# Altium project Laser_driver.PrjPCB (part 2 of 3)

## Sheet LD.SchDoc
size A2; SPICEModelCacheJOXINVFD: <root> / <DocumentId>JOXINVFD</DocumentId> / <CacheFrame Number="0"> / <Model Name="0603_885012206095_100nf" Kind="CKT"> / <Text>******* / .subckt 0603_885012206095_100nF 1 2 / Rser 1 3 0.0157659152881 / Lser 2 4 3.10171966E-10 / C1 3 4 0.0000001 / Rpar 3 4 5000000000 / .ends 0603_885012206095_100nF</Text> / </Model> / </CacheFrame> / </root>
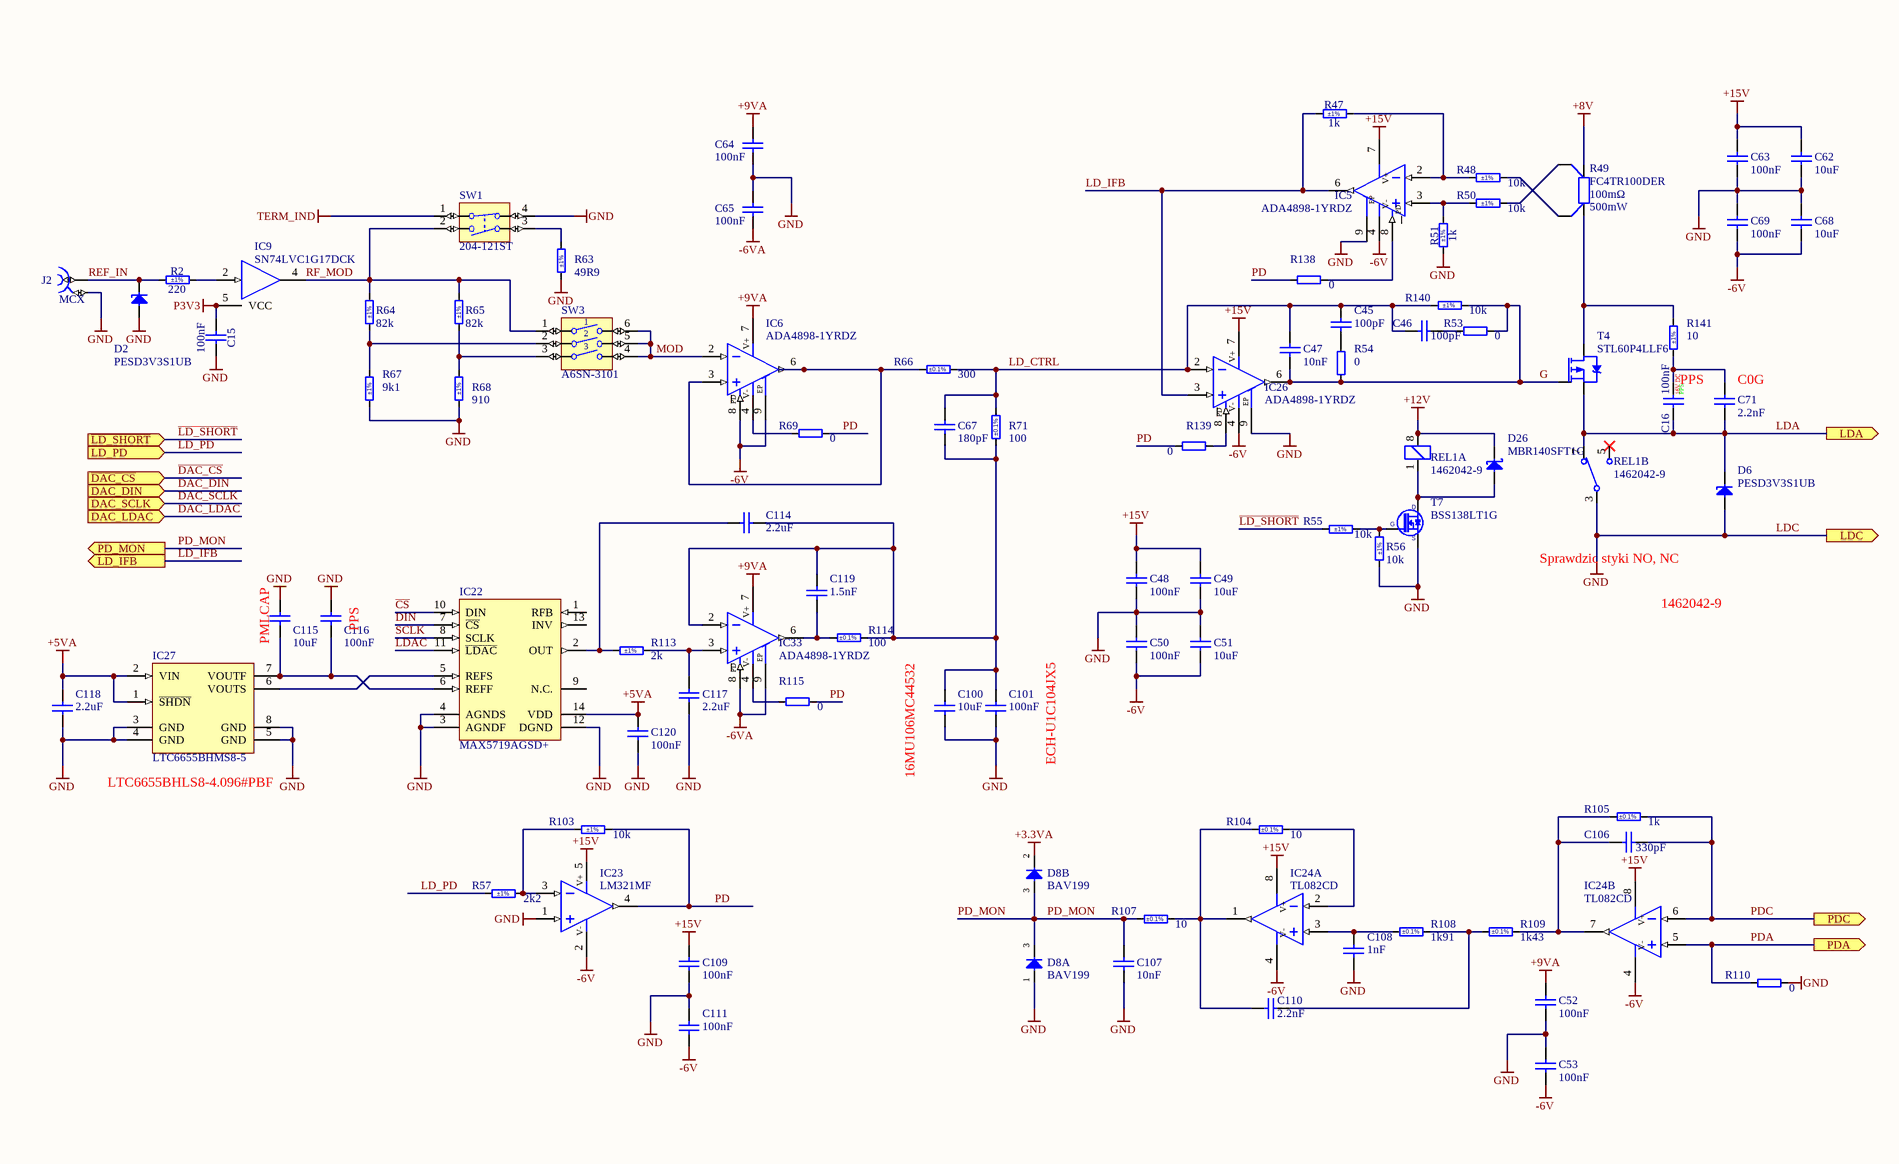
[diagram p2: LD.SchDoc, left]
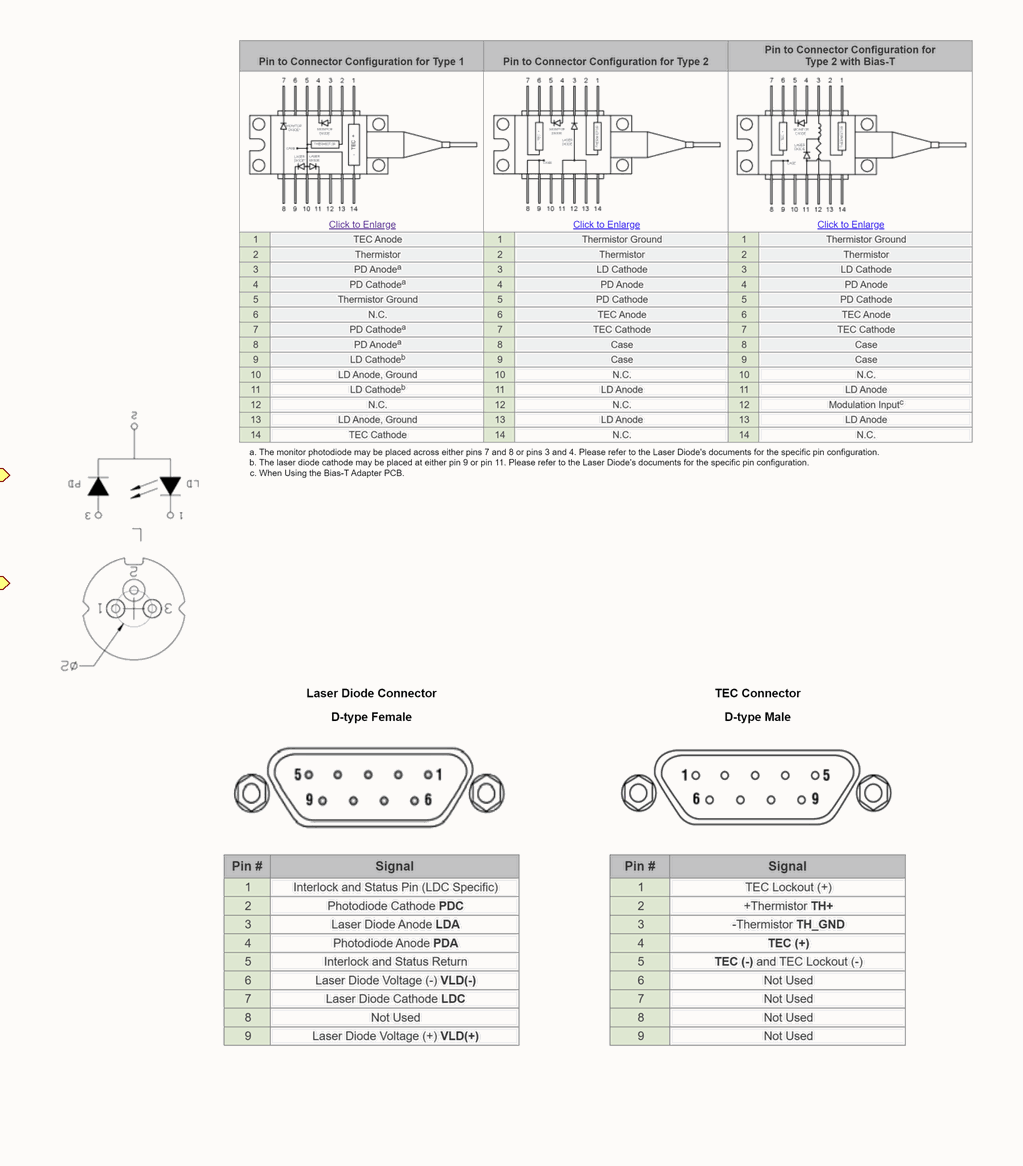
[diagram p3: LD.SchDoc, right]

### Parts
C15  100nF  [CAPC1005X55N]
C16  100nF  Value3: 16V DC  DielectrikType: PPS  [PPS_G3_size]
C45  100pF  [CAPC1608X90N]
C46  100pF  [CAPC1608X90N]
C47  10nF  [CAPC1608X87N]
C48  100nF  [WCAP-CSGP_0603_L1.6W0.8H0.8_Reflow]
C49  10uF  [CAPC1709X100N]
C50  100nF  [WCAP-CSGP_0603_L1.6W0.8H0.8_Reflow]
C51  10uF  [CAPC1709X100N]
C52  100nF  [WCAP-CSGP_0603_L1.6W0.8H0.8_Reflow]
C53  100nF  [WCAP-CSGP_0603_L1.6W0.8H0.8_Reflow]
C62  10uF  [CAPC1709X100N]
C63  100nF  [WCAP-CSGP_0603_L1.6W0.8H0.8_Reflow]
C64  100nF  [WCAP-CSGP_0603_L1.6W0.8H0.8_Reflow]
C65  100nF  [WCAP-CSGP_0603_L1.6W0.8H0.8_Reflow]
C67  180pF  [CAPC1608X87N]
C68  10uF  [CAPC1709X100N]
C69  100nF  [WCAP-CSGP_0603_L1.6W0.8H0.8_Reflow]
C71  2.2nF  [CAPC1608X87N]
C100  10uF  [CAPC1709X100N]
C101  100nF  [CAPC3225X230N]
C106  330pF  [CAPC1608X87N]
C107  10nF  [CAPC1608X87N]
C108  1nF  [CAPC1608X90N]
C109  100nF  [WCAP-CSGP_0603_L1.6W0.8H0.8_Reflow]
C110  2.2nF  [CAPC1608X87N]
C111  100nF  [WCAP-CSGP_0603_L1.6W0.8H0.8_Reflow]
C114  2.2uF  [CAPC2012X135N]
C115  10uF  [CAPC1709X100N]
C116  100nF  [CAPC3225X230N]
C117  2.2uF  [CAPC2012X135N]
C118  2.2uF  [CAPC2012X135N]
C119  1.5nF  [CAPC1608X87N]
C120  100nF  [CAPC3225X230N]
D2  PESD3V3S1UB  [SODFL1608X65N]
D6  PESD3V3S1UB  [SODFL1608X65N]
D8  BAV199  [SOT95P240X110-3N]  (parts A,B of 2)
D26  MBR140SFT1G  [SOD-123FL]
IC5  ADA4898-1YRDZ  [SOIC127P600X175-9N-S229]
IC6  ADA4898-1YRDZ  [SOIC127P600X175-9N-S229]
IC9  SN74LVC1G17DCK  [SOT65P210X110-5N]
IC22  MAX5719AGSD+  [SOIC127P600X175-14N]
IC23  LM321MF  [SOT95P280X145-5N]
IC24  TL082CD  [SOIC127P600X175-8N]  (parts A,B of 2)
IC26  ADA4898-1YRDZ  [SOIC127P600X175-9N-S229]
IC27  LTC6655BHMS8-5  [SOP65P490X110-8N]
IC33  ADA4898-1YRDZ  [SOIC127P600X175-9N-S229]
J2  MCX  [AMPHENOL_919-109J-51PX]
R2  220  Tolerance: ±1%  [RESC1005X40N]
R47  1k  Tolerance: ±1%  [RESC1608X55N]
R48  10k  Tolerance: ±1%  [RESC1608X55N]
R49  FC4TR100DER  Value1: 100mΩ  Value2: 500mW  [FC4T]
R50  10k  Tolerance: ±1%  [RESC1608X55N]
R51  1k  Tolerance: ±1%  [RESC1608X55N]
R53  0  [RESC1608X55N]
R54  0  [RESC1608X55N]
R55  10k  Tolerance: ±1%  [RESC1608X55N]
R56  10k  Tolerance: ±1%  [RESC1608X55N]
R57  2k2  Tolerance: ±1%  [RESC1005X40N]
R63  49R9  Tolerance: ±1%  [RESC1608X55N]
R64  82k  Tolerance: ±1%  [RESC1608X55N]
R65  82k  Tolerance: ±1%  [RESC1608X55N]
R66  300  Tolerance: ±0.1%  [RESC1608X64N]
R67  9k1  Tolerance: ±1%  [RESC1608X55N]
R68  910  Tolerance: ±1%  [RESC1608X55N]
R69  0  [RESC1608X55N]
R71  100  Tolerance: ±0.1%  [RESC1608X55N]
R103  10k  Tolerance: ±1%  [RESC1608X55N]
R104  10  Tolerance: ±0.1%  [RESC1608X55N]
R105  1k  Tolerance: ±0.1%  [RESC1608X64N]
R107  10  Tolerance: ±0.1%  [RESC1608X55N]
R108  1k91  Tolerance: ±0.1%  [RESC1608X55N]
R109  1k43  Tolerance: ±0.1%  [RESC1608X55N]
R110  0  [RESC1608X55N]
R113  2k  Tolerance: ±1%  [RESC1608X55N]
R114  100  Tolerance: ±0.1%  [RESC1608X55N]
R115  0  [RESC1608X55N]
R138  0  [RESC1608X55N]
R139  0  [RESC1608X55N]
R140  10k  Tolerance: ±1%  [RESC1608X55N]
R141  10  Tolerance: ±1%  [RESC3216X65N]
REL1  1462042-9  [1462042-9]  (parts A,B of 2)
SW1  Manufacturer Part Number: 204-121ST  [SW_CTS_204-121ST]  (hidden comment: Switch)
SW3  Manufacturer Part Number: A6SN-3101  [SW_OMRON_A6SN-3101]  (hidden comment: Switch)
T4  STL60P4LLF6  [8-PowerVDFN]
T7  BSS138LT1G  [SOT95P240X110-3N]

### Ports
DAC_DIN (in), DAC_LDAC (in), DAC_SCLK (in), LD_IFB (out), LD_PD (in), LDA (out), LDC (out), PD_MON (out), PDA (out), PDC (out), ~{DAC_CS} (in), ~{LD_SHORT} (in)

### Nets
+3.3VA: D8.2(C)
+5VA: C118.2 C120.1 IC22.14(VDD) IC27.1(~{SHDN}) IC27.2(VIN)
+8V: R49.4
+9VA: C52.2 C64.2 IC6.7(V+) IC33.7(V+)
+12V: D26.1(C) REL1.8(A2-)
+15V: C48.2 C49.2 C62.2 C63.2 C109.2 IC5.7(V+) IC24.8(V+) IC26.7(V+)
-6V: C50.1 C51.1 C53.1 C68.1 C69.1 C111.1 IC5.4(V-) IC6.8(~{DS}) IC6.9(EP) IC23.2(V-) IC24.4(V-) IC26.4(V-)
-6VA: C65.1 IC33.8(~{DS}) IC33.9(EP)
LDC: C15.1 C48.1 C49.1 C50.2 C51.2 C52.1 C53.2 C62.1 C63.1 C64.1 C65.2 C68.2 C69.2 C100.1 C101.1 C107.1 C108.1 C109.1 C111.2 C115.2 C116.2 C117.1 C118.1 C120.2 D2.2(A) D6.2(A) D8.1(A) IC5.9(EP) IC9.3(GND) IC22.3(AGNDF) IC22.4(AGNDS) IC22.12(DGND) IC23.1(IN+) IC26.9(EP) IC27.3(GND) IC27.4(GND) IC27.5(GND) IC27.8(GND) J2.2 R51.1 R56.1 R63.2 R67.1 R68.1 R110.2 REL1.3 SW1.4 T7.2(S) ; port LDC  [also labelled GND]
P3V3: C15.2 IC9.5(VCC)
TERM_IND: SW1.1
~{CS}: IC22.10(DIN)
~{DAC_CS}: port ~{DAC_CS}  [project net ~{CS}]
DAC_DIN: port DAC_DIN
DAC_~{LDAC}: port DAC_LDAC
DAC_SCLK: port DAC_SCLK
DIN: IC22.7(~{CS})
G: C47.1 IC26.6(OUT) R53.2 R54.1 R140.2 T4.4(G)
~{LD_SHORT}: R55.1 ; port ~{LD_SHORT}
~{LDAC}: IC22.11(~{LDAC})
LD_CTRL: C45.2 C46.1 C47.2 C67.2 IC26.2(IN-) R66.2 R71.2 R140.1
LD_IFB: IC5.6(OUT) IC26.3(IN+) R47.1 ; port LD_IFB
LD_PD: R57.1 ; port LD_PD
LDA: C16.1 C71.1 D6.1(C) REL1.7 T4.1,_2,_3(S) ; port LDA
MOD: IC6.2(IN-) SW3.4 SW3.5 SW3.6
PD: IC23.4(OUT) R69.2 R103.2 R115.2 R138.1 R139.2
PD_MON: C107.2 D8.3(COMAC) R107.1 ; port PD_MON
PDA: IC24.5(IN+) R110.1 ; port PDA
PDC: C106.2 IC24.6(IN-) R105.2 ; port PDC
REF_IN: D2.1(C) J2.1 R2.2
RF_MOD: IC9.4(OUT) R64.2 R65.2 SW1.2 SW3.1
SCLK: IC22.8(SCLK)
NetC16_2: C16.2 C71.2 R141.1
NetC45_1: C45.1 R54.2
NetC46_2: C46.2 R53.1
NetC67_1: C67.1 C100.2 C101.2 C114.2 C119.2 IC33.2(IN-) R71.1 R114.2
NetC106_1: C106.1 IC24.7(OUT) R105.1 R109.2
NetC108_2: C108.2 IC24.3(IN+) R108.1
NetC110_1: C110.1 IC24.1(OUT) R104.1 R107.2
NetC110_2: C110.2 R108.2 R109.1
NetC114_1: C114.1 IC22.2(OUT) R113.1
NetC115_1: C115.1 C116.1 IC22.6(REFF) IC27.7(VOUTF)
NetC117_2: C117.2 IC33.3(IN+) R113.2
NetC119_1: C119.1 IC33.6(OUT) R114.1
NetD26_2: D26.2(A) REL1.1(A1+) T7.3(D)
NetIC5_2: IC5.2(IN-) R47.2 R48.1
NetIC5_3: IC5.3(IN+) R50.1 R51.2
NetIC5_8: IC5.8(~{DS}) R138.2
NetIC6_3: IC6.3(IN+) IC6.6(OUT) R66.1
NetIC6_4: IC6.4(V-) R69.1
NetIC9_2: IC9.2(IN) R2.1
NetIC22_5: IC22.5(REFS) IC27.6(VOUTS)
NetIC23_3: IC23.3(IN-) R57.2 R103.1
NetIC24_2: IC24.2(IN-) R104.2
NetIC26_8: IC26.8(~{DS}) R139.1
NetIC33_4: IC33.4(V-) R115.1
NetR48_2: R48.2 R49.2
NetR49_1: R49.1 R50.2
NetR49_3: R49.3 R141.2 T4.5(D)
NetR55_2: R55.2 R56.2 T7.1(G)
NetR63_1: R63.1 SW1.3
NetR64_1: R64.1 R67.2 SW3.2
NetR65_1: R65.1 R68.2 SW3.3

Not connected (* = marked no-connect by the designer): IC22 1(RFB) 9(N.C.) 13(INV); IC23 5(V+); REL1 5*

### Notes on the sheet
- (near C16) PPS
- (near C71) C0G
- Sprawdzic styki NO, NC
- 1462042-9
- (near C115) PMLCAP
- (near C116) PPS
- (near IC27) LTC6655BHLS8-4.096#PBF
- (near C100) 16MU106MC44532
- (near C101) ECH-U1C104JX5
- Labels drawn without touching a wire or pin: +15V
- (in symbol ADA4898-1YRDZ) PD

### Library data of the parts
C15 = CC0402_100NF_16V_10%_X7R: Non-polarised capacitor; Part Description: SMD Multilayer Chip Ceramic Capacitor; Manufacturer: GENERIC; Manufacturer1 Part Number: GRM155R71C104KA88D; Voltage: 16V; TC: X7R; Tolerance: ±10%; Part Number: CC0402_100NF_16V_10%_X7R; Component Kind: Standard; Component Type: Standard; Pin Count: 2; Value: 100nF; Status: Not Recommended; Manufacturer Part Number: CC0402_100NF_16V_10%_X7R; Case: 0402; Mounted: Yes; Socket: No; SMD: Yes; Sense: No; Manufacturer1 Example: MURATA; Manufacturer1 ComponentHeight: 0.55mm; HelpURL: \\cern.ch\dfs\Applications\Altium\Datasheets\CC0402_X7R_MURATA_GRM.pdf; Author: CERN DEM JLC; CreateDate: 05.12.2013; LatestRevisionDate: 03.12.2007
C16 = 100nF/50V/1206/PPS: 0.1 µF Film Capacitor 11V 16V Polyphenylene Sulfide (PPS), Metallized - Stacked 1210 (3225 Metric); Manufacture: Panasonic; Assembly: SMD; Parameter1: Cap; Parameter2: Vr AC; ComponentSymbol: ECH-U1C104JX5; Tolerance1: ±5%; Parameter3: Vr DC; Value2: 11V AC; ComponentLink1URL: https://industrial.panasonic.com/cdbs/www-data/pdf/RDI0000/ABD0000C173.pdf; ComponentLink1Description: Datasheet; Shop1ID: *; ComponentType: Capacitor; Tolerance2: *; Value1: 100nF
C45 C46 = CC0603_100PF_50V_1%_NP0: Non-polarised capacitor; Part Description: SMD Multilayer Chip Ceramic Capacitor; Manufacturer: GENERIC; Manufacturer1 Part Number: 06035A101FAT2A; Voltage: 50V; TC: C0G/NP0; Tolerance: ±1%; Part Number: CC0603_100PF_50V_1%_NP0; Component Kind: Standard; Component Type: Standard; Pin Count: 2; Value: 100pF; Status: None; Manufacturer Part Number: CC0603_100PF_50V_1%_NP0; Case: 0603; Mounted: Yes; Socket: No; SMD: Yes; Sense: No; Manufacturer1 Example: AVX; Manufacturer1 ComponentHeight: 0.9mm; HelpURL: \\cern.ch\dfs\Applications\Altium\Datasheets\CC0603_C0G_AVX.pdf; Author: CERN DEM JLC; CreateDate: 15.06.2017; LatestRevisionDate: 15.06.2017
C47 C107 = CC0603_10NF_25V_1%_C0G: Non-polarised capacitor; Part Description: SMD Multilayer Chip Ceramic Capacitor; Manufacturer: GENERIC; Manufacturer1 Part Number: C0603C103F3GEC; Voltage: 25V; TC: C0G/NP0; Tolerance: ±1%; Part Number: CC0603_10NF_25V_1%_C0G; Component Kind: Standard; Component Type: Standard; Pin Count: 2; Value: 10nF; Status: None; Manufacturer Part Number: CC0603_10NF_25V_1%_C0G; Case: 0603; Mounted: Yes; Socket: No; SMD: Yes; Sense: No; Manufacturer1 Example: KEMET; Manufacturer1 ComponentHeight: 0.87mm; HelpURL: \\cern.ch\dfs\Applications\Altium\Datasheets\CC0603_ESD_C0G_KEMET.pdf; Author: CERN DEM HF; CreateDate: 07.02.2024; LatestRevisionDate: 07.02.2024
C48 C50 C52 C53 C63-C65 C69 C109 C111 = 885012206095: WCAP-CSGP Multilayer Ceramic Chip Capacitor, General Purpose, size 0603, 100nF, 50V; Manufacturer: Wurth Elektronik; Case/Size Code: 0603; Capacitance Tolerance: +/-10%; Ceramic Type: X7R; Dissipation Factor: 3%; Insulation Resistance: 5GΩ; Technical Reference: X7R0603104K050DFCT10000; Manufacturer Part Number: 885012206095; Category: Multilayer Ceramic Chip Capacitors; Match Code: WCAP-CSGP; ComponentLink1Description: Website Link; ComponentLink1URL: https://www.we-online.com/redexpert/article/885012206095?ad; ComponentLink2Description: Datasheet Link; ComponentLink2URL: https://www.we-online.com/redexpert/spec/885012206095?ad; Mount: Surface Mount; Min Operating Temperature: -55°C; Max Operating Temperature: 125°C; Packaging: Tape and Reel; Length: 1.6mm; Width: 0.8mm; Height: 0.8mm; Capacitance: 100nF; Rated Voltage (DC): 50V
C49 C51 C62 C68 C100 C115 = CC0603_10UF_6.3V_20%_X7R_SAMSUNG_CL: Non-polarised capacitor; Part Description: SMD Multilayer Chip Ceramic Capacitor; Manufacturer: SAMSUNG ELECTRO-MECHANICS; Manufacturer Part Number: CL10B106MQ8NR; Voltage: 6.3V; TC: X7R; Tolerance: ±20%; Part Number: CC0603_10UF_6.3V_20%_X7R_SAMSUNG_CL; Component Kind: Standard; Component Type: Standard; Pin Count: 2; Value: 10uF; Status: Not Recommended; Case: 0603; Mounted: Yes; Socket: No; SMD: Yes; Sense: No; ComponentHeight: 1mm; HelpURL: \\cern.ch\dfs\Applications\Altium\Datasheets\CC0603_X7R_SAMSUNG_CL10B106MQ8NR.pdf; Author: CERN DEM BC; CreateDate: 12.10.2020; LatestRevisionDate: 12.10.2020
C67 = CC0603_180PF_50V_5%_NP0: Non-polarised capacitor; Part Description: SMD Multilayer Chip Ceramic Capacitor; Manufacturer: GENERIC; Manufacturer1 Part Number: 223886715181; Voltage: 50V; TC: C0G/NP0; Tolerance: ±5%; Part Number: CC0603_180PF_50V_5%_NP0; Component Kind: Standard; Component Type: Standard; Pin Count: 2; Value: 180pF; Status: Preferred; Manufacturer Part Number: CC0603_180PF_50V_5%_NP0; Case: 0603; Mounted: Yes; Socket: No; SMD: Yes; Sense: No; Manufacturer1 Example: PHYCOMP; Manufacturer1 ComponentHeight: 0.87mm; HelpURL: \\cern.ch\dfs\Applications\Altium\Datasheets\CC0603_NP0_PHYCOMP.pdf; Author: CERN DEM JLC; CreateDate: 03.12.2007; LatestRevisionDate: 03.12.2007
C71 C110 = CC0603_2.2NF_50V_5%_C0G: Non-polarised capacitor; Part Description: SMD Multilayer Chip Ceramic Capacitor; Manufacturer: GENERIC; Manufacturer1 Part Number: C1608C0G1H222J080; Voltage: 50V; TC: C0G/NP0; Tolerance: ±5%; Part Number: CC0603_2.2NF_50V_5%_C0G; Component Kind: Standard; Component Type: Standard; Pin Count: 2; Value: 2.2nF; Status: Preferred; Manufacturer Part Number: CC0603_2.2NF_50V_5%_C0G; Case: 0603; Mounted: Yes; Socket: No; SMD: Yes; Sense: No; Manufacturer1 Example: TDK; Manufacturer1 ComponentHeight: 0.9mm; HelpURL: \\cern.ch\dfs\Applications\Altium\Datasheets\CC0603_C0G_TDK_C.pdf; Author: CERN DEM JMW; CreateDate: 23.06.2014; LatestRevisionDate: 23.06.2014
C101 C116 C120 = CPPS1210_100NF_16V_5%_PANASONIC_ECHU(X): Non-polarised capacitor; Part Description: Stacked Metallized PPS (Polyphenylene Sulfide) Film Chip Capacitor; Manufacturer Part Number: ECHU1C104JX5; Voltage: 16V; Tolerance: ±5%; Part Number: CPPS1210_100NF_16V_5%_PANASONIC_ECHU(X); Component Kind: Standard; Component Type: Standard; Pin Count: 2; Value: 100nF; Status: None; Manufacturer: PANASONIC; Case: 1210; Mounted: Yes; Socket: No; SMD: Yes; Sense: No; ComponentHeight: 2.3mm; HelpURL: \\cern.ch\dfs\Applications\Altium\Datasheets\CPPS1210_PANASONIC_ECHU(X).pdf; Author: CERN DEM JLC; CreateDate: 15.06.2011; LatestRevisionDate: 15.06.2011
C106 = CC0603_330PF_50V_5%_NP0: Non-polarised capacitor; Part Description: SMD Multilayer Chip Ceramic Capacitor; Manufacturer: GENERIC; Manufacturer1 Part Number: 223886715331; Voltage: 50V; TC: C0G/NP0; Tolerance: ±5%; Part Number: CC0603_330PF_50V_5%_NP0; Component Kind: Standard; Component Type: Standard; Pin Count: 2; Value: 330pF; Status: Preferred; Manufacturer Part Number: CC0603_330PF_50V_5%_NP0; Case: 0603; Mounted: Yes; Socket: No; SMD: Yes; Sense: No; Manufacturer1 Example: PHYCOMP; Manufacturer1 ComponentHeight: 0.87mm; HelpURL: \\cern.ch\dfs\Applications\Altium\Datasheets\CC0603_NP0_PHYCOMP.pdf; Author: CERN DEM JLC; CreateDate: 03.12.2007; LatestRevisionDate: 03.12.2007
C108 = CC0603_1NF_50V_5%_NP0: Non-polarised capacitor; Part Description: SMD Multilayer Chip Ceramic Capacitor; Manufacturer: GENERIC; Manufacturer1 Part Number: CC0603JRNPO9BN102; Voltage: 50V; TC: C0G/NP0; Tolerance: ±5%; Part Number: CC0603_1NF_50V_5%_NP0; Component Kind: Standard; Component Type: Standard; Pin Count: 2; Value: 1nF; Status: Preferred; Manufacturer Part Number: CC0603_1NF_50V_5%_NP0; Case: 0603; Mounted: Yes; Socket: No; SMD: Yes; Sense: No; Manufacturer1 Example: YAGEO PHYCOMP; Manufacturer1 ComponentHeight: 0.9mm; HelpURL: \\cern.ch\dfs\Applications\Altium\Datasheets\CC0805_NP0_PHYCOMP_16VTO50V.pdf; Author: CERN DEM JLC; CreateDate: 22.10.2012; LatestRevisionDate: 22.10.2012
C114 C117 C118 = CC0805_2.2UF_16V_10%_X7R: Non-polarised capacitor; Part Description: SMD Multilayer Chip Ceramic Capacitor; Manufacturer: GENERIC; Manufacturer1 Part Number: GRM21BF51C225ZA01L; Voltage: 16V; TC: X7R; Tolerance: ±10%; Part Number: CC0805_2.2UF_16V_10%_X7R; Component Kind: Standard; Component Type: Standard; Pin Count: 2; Value: 2.2uF; Status: Preferred; Manufacturer Part Number: CC0805_2.2UF_16V_10%_X7R; Case: 0805; Mounted: Yes; Socket: No; SMD: Yes; Sense: No; Manufacturer1 Example: MURATA; Manufacturer1 ComponentHeight: 1.5mm; HelpURL: \\cern.ch\dfs\Applications\Altium\Datasheets\CC0805_X7R_MURATA_GRM.pdf; Author: CERN DEM JLC; CreateDate: 03.12.2007; LatestRevisionDate: 18.09.2014
C119 = CC0603_1.5NF_50V_5%_NP0: Non-polarised capacitor; Part Description: SMD Multilayer Chip Ceramic Capacitor; Manufacturer: GENERIC; Manufacturer1 Part Number: GRM1885C1H152JA01D; Voltage: 50V; TC: C0G/NP0; Tolerance: ±5%; Part Number: CC0603_1.5NF_50V_5%_NP0; Component Kind: Standard; Component Type: Standard; Pin Count: 2; Value: 1.5nF; Status: None; Manufacturer Part Number: CC0603_1.5NF_50V_5%_NP0; Case: 0603; Mounted: Yes; Socket: No; SMD: Yes; Sense: No; Manufacturer1 Example: MURATA; Manufacturer1 ComponentHeight: 0.9mm; HelpURL: \\cern.ch\dfs\Applications\Altium\Datasheets\CC0603_NP0_MURATA.pdf; Author: CERN DEM JLC; CreateDate: 08.02.2011; LatestRevisionDate: 08.02.2011
D2 D6 = PESD3V3S1UB: ESD protection diode; Part Description: ESD protection diode (23kV); Manufacturer: NXP SEMICONDUCTORS; Voltage: 3V3; Power: 330W; PressFit: No; Bonding: No; Part Number: PESD3V3S1UB; Component Kind: Standard; Component Type: Standard; Device: PESD3V3S1UB; PackageDescription: Ultra Small Outline Diode Flat Lead (SOD-523), Body; 1.2mm L X 0.8mm W X 0.65mm H, IPC Medium Density; Manufacturer Part Number: PESD3V3S1UB; Pin Count: 2; Case: SOD523; Mounted: Yes; Socket: No; SMD: Yes; Sense: No; ComponentHeight: 0.65mm; HelpURL: \\cern.ch\dfs\Applications\Altium\Datasheets\PESD3V3S1UB.pdf; Author: CERN DEM JLC; CreateDate: 29.11.2012; LatestRevisionDate: 29.11.2012
D8 = BAV199: Serial Diode; Part Description: Low-Leakage Double Diode; Manufacturer: NXP SEMICONDUCTORS; Voltage: 75V; Power: 250mW; PressFit: No; Bonding: No; Part Number: BAV199; Component Kind: Standard; Component Type: Standard; Device: BAV199; PackageDescription: SOT, 0.95mm Pitch; 3 Pin, 1.40mm W X 3.00mm L X 1.10mm H body, IPC Medium Density; Manufacturer Part Number: BAV199; Pin Count: 3; Case: SOT23-3; Mounted: Yes; Socket: No; SMD: Yes; Sense: No; ComponentHeight: 1.1mm; HelpURL: \\cern.ch\dfs\Applications\Altium\Datasheets\BAV199.pdf; Author: CERN DEM JMW; CreateDate: 21.11.2008; LatestRevisionDate: 21.11.2008
D26 = MBR140SFT1G: Schottky Diode; Part Description: Schottky Power Rectifier; Manufacturer: ON SEMICONDUCTOR; Voltage: 40V; Power: 1A; PressFit: No; Bonding: No; Part Number: MBR140SFT1G; Component Kind: Standard; Component Type: Standard; Device: MBR140SFT1G; PackageDescription: Small Outline Diode Flat Lead (SOD-123FL), Body; 2.70mm L X 1.65mm W X 1.0mm H; Manufacturer Part Number: MBR140SF; Pin Count: 2; Case: SOD-123FL; Mounted: Yes; Socket: No; SMD: Yes; Sense: No; ComponentHeight: 1.0mm; HelpURL: \\cern.ch\dfs\Applications\Altium\Datasheets\MBR140SFT1G.pdf; Author: CERN DEM JLC; CreateDate: 06.04.2009; LatestRevisionDate: 24.05.2022
IC5 IC6 IC26 IC33 = ADA4898-1YRDZ: High Voltage, Low Noise, Low Distortion, Unity-Gain Stable, High Speed Operational Amplifier; Part Description: Single, High Voltage, Low Noise, Low Distortion, Unity-Gain Stable, High Speed Operational Amplifier; Manufacturer: ANALOG DEVICES; PressFit: No; Bonding: No; Part Number: ADA4898-1YRDZ; Component Kind: Standard; Component Type: Standard; Device: ADA4898-1YRDZ; PackageDescription: SOIC, 1.27mm Pitch; 8 Pin, 3.90mm W X 4.90mm L X 1.75mm H body (w/Thermal Tab 2.29 X 2.29mm), IPC Medium Density; Manufacturer Part Number: ADA4898-1YRD; Pin Count: 9; Case: SOIC8; Mounted: Yes; Socket: No; SMD: Yes; Sense: No; ComponentHeight: 1.75mm; Author: CERN DEM JLC; HelpURL: \\cern.ch\dfs\Applications\Altium\Datasheets\ADA4898-1YRDZ.pdf; CreateDate: 14.04.2014; LatestRevisionDate: 31.03.2022
IC9 = SN74LVC1G17DCK: Single Schmitt-Trigger Buffer; Manufacturer: TEXAS INSTRUMENTS; PressFit: No; Bonding: No; Part Number: SN74LVC1G17DCK; Component Kind: Standard; Component Type: Standard; Device: SN74LVC1G17DCK; PackageDescription: SOT353, SC70-5, 0.65mm Pitch; 5 Pin, 1.25mm W X 2.00mm L X 1.10mm H body, IPC Medium Density; Part Description: Single Schmitt-Trigger Buffer; Manufacturer Part Number: SN74LVC1G17DCK; Pin Count: 5; Case: SOT353; Mounted: Yes; Socket: No; SMD: Yes; Sense: No; ComponentHeight: 1.45mm; Author: CERN DEM HF; HelpURL: \\cern.ch\dfs\Applications\Altium\Datasheets\SN74LVC1G17.pdf; CreateDate: 05.12.2024; LatestRevisionDate: 05.12.2024
IC22 = MAX5719AGSD+: +5V, Serial-Input, Voltage Output, 20-Bit DAC; Manufacturer: MAXIM; PressFit: No; Bonding: No; Part Number: MAX5719AGSD+; Component Kind: Standard; Component Type: Standard; Device: MAX5719AGSD+; PackageDescription: SOIC 14, Pitch 1.27mm - Body 4x8.75mm, IPC Medium Density; Part Description: +5V, Serial-Input, Voltage Output, 20-Bit DAC; Manufacturer Part Number: MAX5719AGSD; Pin Count: 14; Case: SOIC14; Mounted: Yes; Socket: No; SMD: Yes; Sense: No; ComponentHeight: 1.75mm; Author: CERN DEM JLC; HelpURL: \\cern.ch\dfs\Applications\Altium\Datasheets\MAX5719AGSD+.pdf; ComponentLink1URL: \\cern.ch\dfs\Applications\Altium\Datasheets\MAX5719AGSD+_Package.pdf; ComponentLink1Description: Package Drawing; CreateDate: 05.03.2019; LatestRevisionDate: 04.04.2022
IC23 = LM321MF/NOPB: Low Power Single Operational Amplifier; Manufacturer: TEXAS INSTRUMENTS; PressFit: No; Bonding: No; Part Number: LM321MF/NOPB; Component Kind: Standard; Component Type: Standard; Device: LM321MF; PackageDescription: SOT, 0.95mm Pitch; 5 Pin, 1.60mm W X 2.90mm L X 1.45mm H body, IPC Medium Density; Part Description: Low Power Single Operational Amplifier; Manufacturer Part Number: LM321MF; Pin Count: 5; Case: SOT23-5; Mounted: Yes; Socket: No; SMD: Yes; Sense: No; ComponentHeight: 1.45mm; Author: CERN DEM BC; HelpURL: \\cern.ch\dfs\Applications\Altium\Datasheets\LM321MF-NOPB.pdf; CreateDate: 04.09.2015; LatestRevisionDate: 01.06.2022
IC24 = TL082CD: Dual Operational Amplifier; Part Description: Dual JFET-Input Operational Amplifier; Manufacturer: TEXAS INSTRUMENTS; PressFit: No; Bonding: No; Part Number: TL082CD; Component Kind: Standard; Component Type: Standard; Device: TL082CD; PackageDescription: SOIC 8, Pitch 1.27mm - Body 4x5mm, IPC Medium Density; Manufacturer Part Number: TL082CD; Pin Count: 8; Case: SOIC8; Mounted: Yes; Socket: No; SMD: Yes; Sense: No; ComponentHeight: 1.75mm; Author: CERN DEM JLC; HelpURL: \\cern.ch\dfs\Applications\Altium\Datasheets\TL082CD.pdf; CreateDate: 20.05.2010; LatestRevisionDate: 20.05.2010
IC27 = LTC6655BHMS8-5#PBF: 0.25ppm Noise, Low Drift Precision Buffered Voltage Reference; Part Description: 5V, 0.25ppm Noise, Low Drift Precision Buffered Voltage Reference; Manufacturer: LINEAR TECHNOLOGY; PressFit: No; Bonding: No; Part Number: LTC6655BHMS8-5#PBF; Component Kind: Standard; Component Type: Standard; Device: LTC6655BHMS8-5; PackageDescription: SOP, 8-Leads, Body 3.1x3.1mm (max), Pitch 0.65mm, IPC Medium Density; Manufacturer Part Number: LTC6655BHMS8-5; Pin Count: 8; Case: SSOP8; Mounted: Yes; Socket: No; SMD: Yes; Sense: No; ComponentHeight: 1.1mm; HelpURL: \\cern.ch\dfs\Applications\Altium\Datasheets\LTC6655BHMS8-5#PBF.pdf; Author: CERN DEM JLC; CreateDate: 07.06.2012; LatestRevisionDate: 07.06.2012
J2 = AMPHENOL_919-109J-51PX: Part Description: 50 Ohms, RF Connector, MCX Straight PCB Receptacle Jack; Manufacturer Part Number: 919-109J-51PX (MCX6251B1-3GT30G-50); PressFit: No; Part Number: AMPHENOL_919-109J-51PX; Component Kind: Standard; Component Type: Standard; Pin Count: 5; Family: MCX; Mounted: Yes; Socket: No; SMD: No; Sense: No; Status: None; Manufacturer: AMPHENOL; ComponentHeight: 6.06mm; HelpURL: \\cern.ch\dfs\Applications\Altium\Datasheets\AMPHENOL_919-109J-51PX.pdf; Author: CERN DEM BC; CreateDate: 31.01.2019; LatestRevisionDate: 31.01.2019
R2 = R0402_220R_1%_0.0625W_100PPM: Resistor - 1%; Part Description: General Purpose Thick Film Chip Resistor; Manufacturer: GENERIC; Manufacturer1 Part Number: 232270672201L; TC: ±100ppm/°C; PressFit: No; Part Number: R0402_220R_1%_0.0625W_100PPM; Component Kind: Standard; Component Type: Standard; Pin Count: 2; Value: 220; Status: Not Recommended; Power: 0.0625W; Manufacturer Part Number: R0402_220R_1%_0.0625W_100PPM; Case: 0402; Mounted: Yes; Sense: No; Socket: No; SMD: Yes; Manufacturer1 Example: YAGEO PHYCOMP; Manufacturer1 ComponentHeight: 0.4mm; HelpURL: \\cern.ch\dfs\Applications\Altium\Datasheets\R0402_Phycomp_RC0402.pdf; Author: CERN DEM JLC; CreateDate: 03.12.2007; LatestRevisionDate: 17.10.2012
R47 R51 = R0603_1K_1%_0.1W_100PPM: Resistor - 1%; Part Description: General Purpose Thick Film Chip Resistor; Manufacturer: GENERIC; Manufacturer1 Part Number: NRC06F1001TRF; Power: 0.1W; TC: ±100ppm/°C; PressFit: No; Part Number: R0603_1K_1%_0.1W_100PPM; Component Kind: Standard; Component Type: Standard; Pin Count: 2; Value: 1k; Status: Preferred; Manufacturer Part Number: R0603_1K_1%_0.1W_100PPM; Case: 0603; Mounted: Yes; Sense: No; Socket: No; SMD: Yes; Manufacturer1 Example: NIC COMPONENT; Manufacturer1 ComponentHeight: 0.55mm; HelpURL: \\cern.ch\dfs\Applications\Altium\Datasheets\R0603_NIC_NRC.pdf; Author: CERN DEM JLC; CreateDate: 03.12.2007; LatestRevisionDate: 13.03.2008
R48 R50 R55 R56 R103 R140 = R0603_10K_1%_0.1W_100PPM: Resistor - 1%; Part Description: General Purpose Thick Film Chip Resistor; Manufacturer: GENERIC; Manufacturer1 Part Number: NRC06F1002TRF; Power: 0.1W; TC: ±100ppm/°C; PressFit: No; Part Number: R0603_10K_1%_0.1W_100PPM; Component Kind: Standard; Component Type: Standard; Pin Count: 2; Value: 10k; Status: Preferred; Manufacturer Part Number: R0603_10K_1%_0.1W_100PPM; Case: 0603; Mounted: Yes; Sense: No; Socket: No; SMD: Yes; Manufacturer1 Example: NIC COMPONENT; Manufacturer1 ComponentHeight: 0.55mm; HelpURL: \\cern.ch\dfs\Applications\Altium\Datasheets\R0603_NIC_NRC.pdf; Author: CERN DEM JLC; CreateDate: 03.12.2007; LatestRevisionDate: 13.03.2008
R49 = FC4TR100DER: 100 mOhms ±0,5% 0,5W, 1/2W Mikroukład rezystory 1206 (3216 metryczne) Wykrywanie prądu Folia metalowa; Manufacture: Ohmit; DafaultFootprint: 1206; Assembly: SMD; Replacement: Tcoeff; Shop1: Digi-Key; Shop1ID: FC4TR100DERCT-ND; Tolerance1: ±0.5%; Parameter1: Res; Parameter2: Ptot; Value3: ±50ppm/°C; ComponentLink1URL: https://www.ohmite.com/assets/docs/res_fc4t.pdf?r=false; ComponentLink1Description: Datasheet; ComponentType: Resistor; ComponentLink2Description: *; ComponentLink2URL: *; ComponentSymbol: FC4TR100DER; MTBF: *; MTTF: *
R53 R54 R69 R110 R115 R138 R139 = R0603_0R_JUMPER: Resistor; Part Description: 1A (0.05R Max DC Resistance) Zero Ohm Jumper; Manufacturer: GENERIC; Manufacturer1 Part Number: NRC06Z0; PressFit: No; Part Number: R0603_0R_JUMPER; Component Kind: Standard; Component Type: Standard; Pin Count: 2; Value: 0; Status: Preferred; Manufacturer Part Number: R0603_0R_JUMPER; Case: 0603; Mounted: Yes; Sense: No; Socket: No; SMD: Yes; Manufacturer1 Example: NIC COMPONENT; Manufacturer1 ComponentHeight: 0.55mm; HelpURL: \\cern.ch\dfs\Applications\Altium\Datasheets\R0603_NIC_NRC.pdf; Author: CERN DEM JLC; CreateDate: 03.12.2007; LatestRevisionDate: 13.03.2008
R57 = R0402_2K2_1%_0.0625W_100PPM: Resistor - 1%; Part Description: General Purpose Thick Film Chip Resistor; Manufacturer: GENERIC; Manufacturer1 Part Number: 232270672202L; TC: ±100ppm/°C; PressFit: No; Part Number: R0402_2K2_1%_0.0625W_100PPM; Component Kind: Standard; Component Type: Standard; Pin Count: 2; Value: 2k2; Status: Not Recommended; Power: 0.0625W; Manufacturer Part Number: R0402_2K2_1%_0.0625W_100PPM; Case: 0402; Mounted: Yes; Sense: No; Socket: No; SMD: Yes; Manufacturer1 Example: YAGEO PHYCOMP; Manufacturer1 ComponentHeight: 0.4mm; HelpURL: \\cern.ch\dfs\Applications\Altium\Datasheets\R0402_Phycomp_RC0402.pdf; Author: CERN DEM JLC; CreateDate: 03.12.2007; LatestRevisionDate: 17.10.2012
R63 = R0603_49R9_1%_0.1W_100PPM: Resistor - 1%; Part Description: General Purpose Thick Film Chip Resistor; Manufacturer: GENERIC; Manufacturer1 Part Number: RC0603FR-0749R9L; Power: 0.1W; TC: ±100ppm/°C; PressFit: No; Part Number: R0603_49R9_1%_0.1W_100PPM; Component Kind: Standard; Component Type: Standard; Pin Count: 2; Value: 49R9; Status: Preferred; Manufacturer Part Number: R0603_49R9_1%_0.1W_100PPM; Case: 0603; Mounted: Yes; Sense: No; Socket: No; SMD: Yes; Manufacturer1 Example: YAGEO PHYCOMP; Manufacturer1 ComponentHeight: 0.55mm; HelpURL: \\cern.ch\dfs\Applications\Altium\Datasheets\R0603_PHYCOMP_RC0603.pdf; Author: CERN DEM JLC; CreateDate: 21.11.2017; LatestRevisionDate: 21.11.2017
R64 R65 = R0603_82K_1%_0.1W_100PPM: Resistor - 1%; Part Description: General Purpose Thick Film Chip Resistor; Manufacturer: GENERIC; Manufacturer1 Part Number: NRC06F8202TRF; Power: 0.1W; TC: ±100ppm/°C; PressFit: No; Part Number: R0603_82K_1%_0.1W_100PPM; Component Kind: Standard; Component Type: Standard; Pin Count: 2; Value: 82k; Status: Preferred; Manufacturer Part Number: R0603_82K_1%_0.1W_100PPM; Case: 0603; Mounted: Yes; Sense: No; Socket: No; SMD: Yes; Manufacturer1 Example: NIC COMPONENT; Manufacturer1 ComponentHeight: 0.55mm; HelpURL: \\cern.ch\dfs\Applications\Altium\Datasheets\R0603_NIC_NRC.pdf; Author: CERN DEM JLC; CreateDate: 03.12.2007; LatestRevisionDate: 13.03.2008
R66 = R0603_300R_0.1%_0.1W_25PPM: Resistor - 0.1%; Part Description: Thin Film Chip Resistor; Manufacturer: GENERIC; Manufacturer1 Part Number: ERA3AEB301V; Power: 0.1W; TC: ±25ppm/°C; PressFit: No; Part Number: R0603_300R_0.1%_0.1W_25PPM; Component Kind: Standard; Component Type: Standard; Pin Count: 2; Value: 300; Status: Not Recommended; Manufacturer Part Number: R0603_300R_0.1%_0.1W_25PPM; Case: 0603; Mounted: Yes; Sense: No; Socket: No; SMD: Yes; Manufacturer1 Example: PANASONIC; Manufacturer1 ComponentHeight: 0.55mm; HelpURL: \\cern.ch\dfs\Applications\Altium\Datasheets\R0603_PANASONIC_ERA.pdf; Author: CERN DEM JLC; CreateDate: 11.01.2017; LatestRevisionDate: 11.01.2017
R67 = R0603_9K1_1%_0.1W_100PPM: Resistor - 1%; Part Description: General Purpose Thick Film Chip Resistor; Manufacturer: GENERIC; Manufacturer1 Part Number: NRC06F9101TRF; Power: 0.1W; TC: ±100ppm/°C; PressFit: No; Part Number: R0603_9K1_1%_0.1W_100PPM; Component Kind: Standard; Component Type: Standard; Pin Count: 2; Value: 9k1; Status: Preferred; Manufacturer Part Number: R0603_9K1_1%_0.1W_100PPM; Case: 0603; Mounted: Yes; Sense: No; Socket: No; SMD: Yes; Manufacturer1 Example: NIC COMPONENT; Manufacturer1 ComponentHeight: 0.55mm; HelpURL: \\cern.ch\dfs\Applications\Altium\Datasheets\R0603_NIC_NRC.pdf; Author: CERN DEM JLC; CreateDate: 03.12.2007; LatestRevisionDate: 13.03.2008
R68 = R0603_910R_1%_0.1W_100PPM: Resistor - 1%; Part Description: General Purpose Thick Film Chip Resistor; Manufacturer: GENERIC; Manufacturer1 Part Number: NRC06F9100TRF; Power: 0.1W; TC: ±100ppm/°C; PressFit: No; Part Number: R0603_910R_1%_0.1W_100PPM; Component Kind: Standard; Component Type: Standard; Pin Count: 2; Value: 910; Status: Preferred; Manufacturer Part Number: R0603_910R_1%_0.1W_100PPM; Case: 0603; Mounted: Yes; Sense: No; Socket: No; SMD: Yes; Manufacturer1 Example: NIC COMPONENT; Manufacturer1 ComponentHeight: 0.55mm; HelpURL: \\cern.ch\dfs\Applications\Altium\Datasheets\R0603_NIC_NRC.pdf; Author: CERN DEM JLC; CreateDate: 03.12.2007; LatestRevisionDate: 13.03.2008
R71 R114 = R0603_100R_0.1%_0.063W_10PPM: Resistor - 0.1%; Part Description: Thin Film Chip Resistor; Manufacturer: GENERIC; Manufacturer1 Part Number: RN73C1J100RBTDF; Power: 0.063W; TC: ±10ppm; PressFit: No; Part Number: R0603_100R_0.1%_0.063W_10PPM; Component Kind: Standard; Component Type: Standard; Pin Count: 2; Value: 100; Status: Not Recommended; Manufacturer Part Number: R0603_100R_0.1%_0.063W_10PPM; Case: 0603; Mounted: Yes; Sense: No; Socket: No; SMD: Yes; Manufacturer1 Example: TYCO HOLSWORTHY; Manufacturer1 ComponentHeight: 0.5mm; HelpURL: \\cern.ch\dfs\Applications\Altium\Datasheets\R0603_Tyco_RN73.pdf; Author: CERN DEM JLC; CreateDate: 03.12.2007; LatestRevisionDate: 13.03.2008
R104 R107 = R0603_10R_0.1%_0.063W_25PPM: Resistor - 0.1%; Part Description: Thin Film Chip Resistor; Manufacturer: GENERIC; Manufacturer1 Part Number: CPF0603B10RE1; Power: 0.063W; TC: ±25ppm; PressFit: No; Part Number: R0603_10R_0.1%_0.063W_25PPM; Component Kind: Standard; Component Type: Standard; Pin Count: 2; Value: 10; Status: Not Recommended; Manufacturer Part Number: R0603_10R_0.1%_0.063W_25PPM; Case: 0603; Mounted: Yes; Sense: No; Socket: No; SMD: Yes; Manufacturer1 Example: TE CONNECTIVITY; Manufacturer1 ComponentHeight: 0.55mm; HelpURL: \\cern.ch\dfs\Applications\Altium\Datasheets\R0603_TYCO_CPF.pdf; Author: CERN DEM JLC; CreateDate: 12.01.2017; LatestRevisionDate: 12.01.2017
R105 = R0603_1K_0.1%_0.1W_25PPM: Resistor - 0.1%; Part Description: Thin Film Chip Resistor; Manufacturer: GENERIC; Manufacturer1 Part Number: ERA3AEB102V; Power: 0.1W; TC: ±25ppm/°C; PressFit: No; Part Number: R0603_1K_0.1%_0.1W_25PPM; Component Kind: Standard; Component Type: Standard; Pin Count: 2; Value: 1k; Status: Not Recommended; Manufacturer Part Number: R0603_1K_0.1%_0.1W_25PPM; Case: 0603; Mounted: Yes; Sense: No; Socket: No; SMD: Yes; Manufacturer1 Example: PANASONIC; Manufacturer1 ComponentHeight: 0.55mm; HelpURL: \\cern.ch\dfs\Applications\Altium\Datasheets\R0603_PANASONIC_ERA.pdf; Author: CERN DEM JLC; CreateDate: 11.01.2017; LatestRevisionDate: 11.01.2017
R108 = R0603_1K91_0.1%_0.063W_10PPM: Resistor - 0.1%; Part Description: Thin Film Chip Resistor; Manufacturer: GENERIC; Manufacturer1 Part Number: RN73C1J1K91BTDF; Power: 0.063W; TC: ±10ppm; PressFit: No; Part Number: R0603_1K91_0.1%_0.063W_10PPM; Component Kind: Standard; Component Type: Standard; Pin Count: 2; Value: 1k91; Status: Not Recommended; Manufacturer Part Number: R0603_1K91_0.1%_0.063W_10PPM; Case: 0603; Mounted: Yes; Sense: No; Socket: No; SMD: Yes; Manufacturer1 Example: TYCO HOLSWORTHY; Manufacturer1 ComponentHeight: 0.5mm; HelpURL: \\cern.ch\dfs\Applications\Altium\Datasheets\R0603_Tyco_RN73.pdf; Author: CERN DEM JLC; CreateDate: 03.12.2007; LatestRevisionDate: 13.03.2008
R109 = R0603_1K43_0.1%_0.063W_10PPM: Resistor - 0.1%; Part Description: Thin Film Chip Resistor; Manufacturer: GENERIC; Manufacturer1 Part Number: RN73C1J1K43BTDF; Power: 0.063W; TC: ±10ppm; PressFit: No; Part Number: R0603_1K43_0.1%_0.063W_10PPM; Component Kind: Standard; Component Type: Standard; Pin Count: 2; Value: 1k43; Status: Not Recommended; Manufacturer Part Number: R0603_1K43_0.1%_0.063W_10PPM; Case: 0603; Mounted: Yes; Sense: No; Socket: No; SMD: Yes; Manufacturer1 Example: TYCO HOLSWORTHY; Manufacturer1 ComponentHeight: 0.5mm; HelpURL: \\cern.ch\dfs\Applications\Altium\Datasheets\R0603_Tyco_RN73.pdf; Author: CERN DEM JLC; CreateDate: 03.12.2007; LatestRevisionDate: 13.03.2008
R113 = R0603_2K_1%_0.1W_100PPM: Resistor - 1%; Part Description: General Purpose Thick Film Chip Resistor; Manufacturer: GENERIC; Manufacturer1 Part Number: NRC06F2001TRF; Power: 0.1W; TC: ±100ppm/°C; PressFit: No; Part Number: R0603_2K_1%_0.1W_100PPM; Component Kind: Standard; Component Type: Standard; Pin Count: 2; Value: 2k; Status: Preferred; Manufacturer Part Number: R0603_2K_1%_0.1W_100PPM; Case: 0603; Mounted: Yes; Sense: No; Socket: No; SMD: Yes; Manufacturer1 Example: NIC COMPONENT; Manufacturer1 ComponentHeight: 0.55mm; HelpURL: \\cern.ch\dfs\Applications\Altium\Datasheets\R0603_NIC_NRC.pdf; Author: CERN DEM JLC; CreateDate: 03.12.2007; LatestRevisionDate: 13.03.2008
R141 = R1206_10R_1%_0.25W_100PPM: Resistor - 1%; Part Description: General Purpose Thick Film Chip Resistor; Manufacturer: GENERIC; Manufacturer1 Part Number: NRC12F10R0TRF; Power: 0.25W; TC: ±100ppm/°C; PressFit: No; Part Number: R1206_10R_1%_0.25W_100PPM; Component Kind: Standard; Component Type: Standard; Pin Count: 2; Value: 10; Status: Preferred; Manufacturer Part Number: R1206_10R_1%_0.25W_100PPM; Case: 1206; Mounted: Yes; Sense: No; Socket: No; SMD: Yes; Manufacturer1 Example: NIC COMPONENT; Manufacturer1 ComponentHeight: 0.65mm; HelpURL: \\cern.ch\dfs\Applications\Altium\Datasheets\R1206_NIC_NRC.pdf; Author: CERN DEM BC; CreateDate: 14.12.2020; LatestRevisionDate: 14.12.2020
REL1 = 1462042-9: Telecom Relay SPDT (1 Form C) Surface Mount; Manufacture: TE Connectivity; Value1: 11.7mA; Shop1: Digi-Key; Shop1ID: PB1250TR-ND; Assembly: SMD; Value2: 250VAC, 220VDC - Max; Value3: 12V; Parameter1: Irel; Parameter2: Urel; Parameter3: Vcoil; ComponentLink1URL: https://www.te.com/commerce/DocumentDelivery/DDEController?Action=srchrtrv&DocNm=108-98025&DocType=SS&DocLang=EN; ComponentLink1Description: Datasheet; Tolerance: *; ComponentType: Relay SPDT (1 Form C); DafaultFootprint: 1462042-9; Replacement: *; ComponentSymbol: 1462042-9
SW1 = SW_CTS_204-121ST: 2x SPST DIP Switch 1NO + 1NF; Part Description: Single SPDT DIP Switch, (1NO + 1NF Coupled), CTS 204 Series; Manufacturer: CTS; PressFit: No; Part Number: SW_CTS_204-121ST; Component Kind: Standard; Component Type: Standard; Pin Count: 4; PackageDescription: Body 7.26 x 9.78mm, 2x SPST DIP, 1NO + 1NF Switch, CTS 204 Series; Family: Switch; Mounted: Yes; Socket: No; SMD: Yes; Sense: No; Status: None; ComponentHeight: 10.36mm; HelpURL: \\cern.ch\dfs\Applications\Altium\Datasheets\SW_CTS_204-121ST.pdf; Author: CERN DEM JLC; CreateDate: 28.08.2014; LatestRevisionDate: 28.08.2014
SW3 = SW_OMRON_A6SN-3101: 3 Ways SPST DIP Switch; Part Description: 3 Ways SPST Surface-Mounting Slide Switch with Flat Actuator, Contact Rating 25mA 24VDC; Manufacturer: OMRON; PressFit: No; Part Number: SW_OMRON_A6SN-3101; Component Kind: Standard; Component Type: Standard; Pin Count: 6; PackageDescription: Pitch 2.54mm, Body 9.6x7.5, 3 Ways SPST Surface-Mounting Slide Switch With Flat Actuator (A6SN Series); Family: Switch; Mounted: Yes; Socket: No; SMD: Yes; Sense: No; Status: None; ComponentHeight: 4.6mm; HelpURL: \\cern.ch\dfs\Applications\Altium\Datasheets\SW_OMRON_A6SN-3101.pdf; Author: CERN DEM MR; CreateDate: 04.11.2016; LatestRevisionDate: 04.11.2016
T4 = STL60P4LLF6: P-Channel 40 V 60A (Tc) 100W (Tc) Surface Mount PowerFlat™ (5x6); Manufacturer: STMicroelectronics; PressFit: No; Bonding: No; Part Number: STL60P4LLF6; Component Kind: Standard; Component Type: Standard; Device: STL60P4LLF6; PackageDescription: PowerFlat™ (5x6); Part Description: P-Channel 40 V 60A (Tc) 100W (Tc) Surface Mount PowerFlat™ (5x6); Manufacturer Part Number: STL60P4LLF6; Pin Count: 8; Case: 8-PowerVDFN; Mounted: Yes; Socket: No; SMD: Yes; Sense: No; ComponentHeight: 1.14mm; HelpURL: https://www.st.com/content/ccc/resource/technical/document/datasheet/group3/07/a0/cb/73/98/ef/48/f8/DM00131739/files/DM00131739.pdf/jcr:content/translations/en.DM00131739.pdf; Author: LPA; CreateDate: 21.08.2025; LatestRevisionDate: 21.08.2025
T7 = BSS138LT1G: N-CHANNEL MOSFET WITH DIODE; Part Description: 50V, 200mA N-Channel Enhancement Mode Field-Effect Transistor; Manufacturer: ON SEMICONDUCTOR; PressFit: No; Bonding: No; Part Number: BSS138LT1G; Component Kind: Standard; Component Type: Standard; Device: BSS138LT1G; PackageDescription: SOT23, 0.95mm Pitch; 3 Pin, 1.40mm W X 3.00mm L X 1.10mm H body, IPC Medium Density; Manufacturer Part Number: BSS138L; Pin Count: 3; Case: SOT23-3; Mounted: Yes; Socket: No; SMD: Yes; Sense: No; ComponentHeight: 1.11mm; HelpURL: \\cern.ch\dfs\Applications\Altium\Datasheets\BSS138LT1G.pdf; Author: CERN DEM JLC; CreateDate: 23.03.2009; LatestRevisionDate: 25.05.2022